# EAGLE design logger2 (EAGLE 6.6.0)
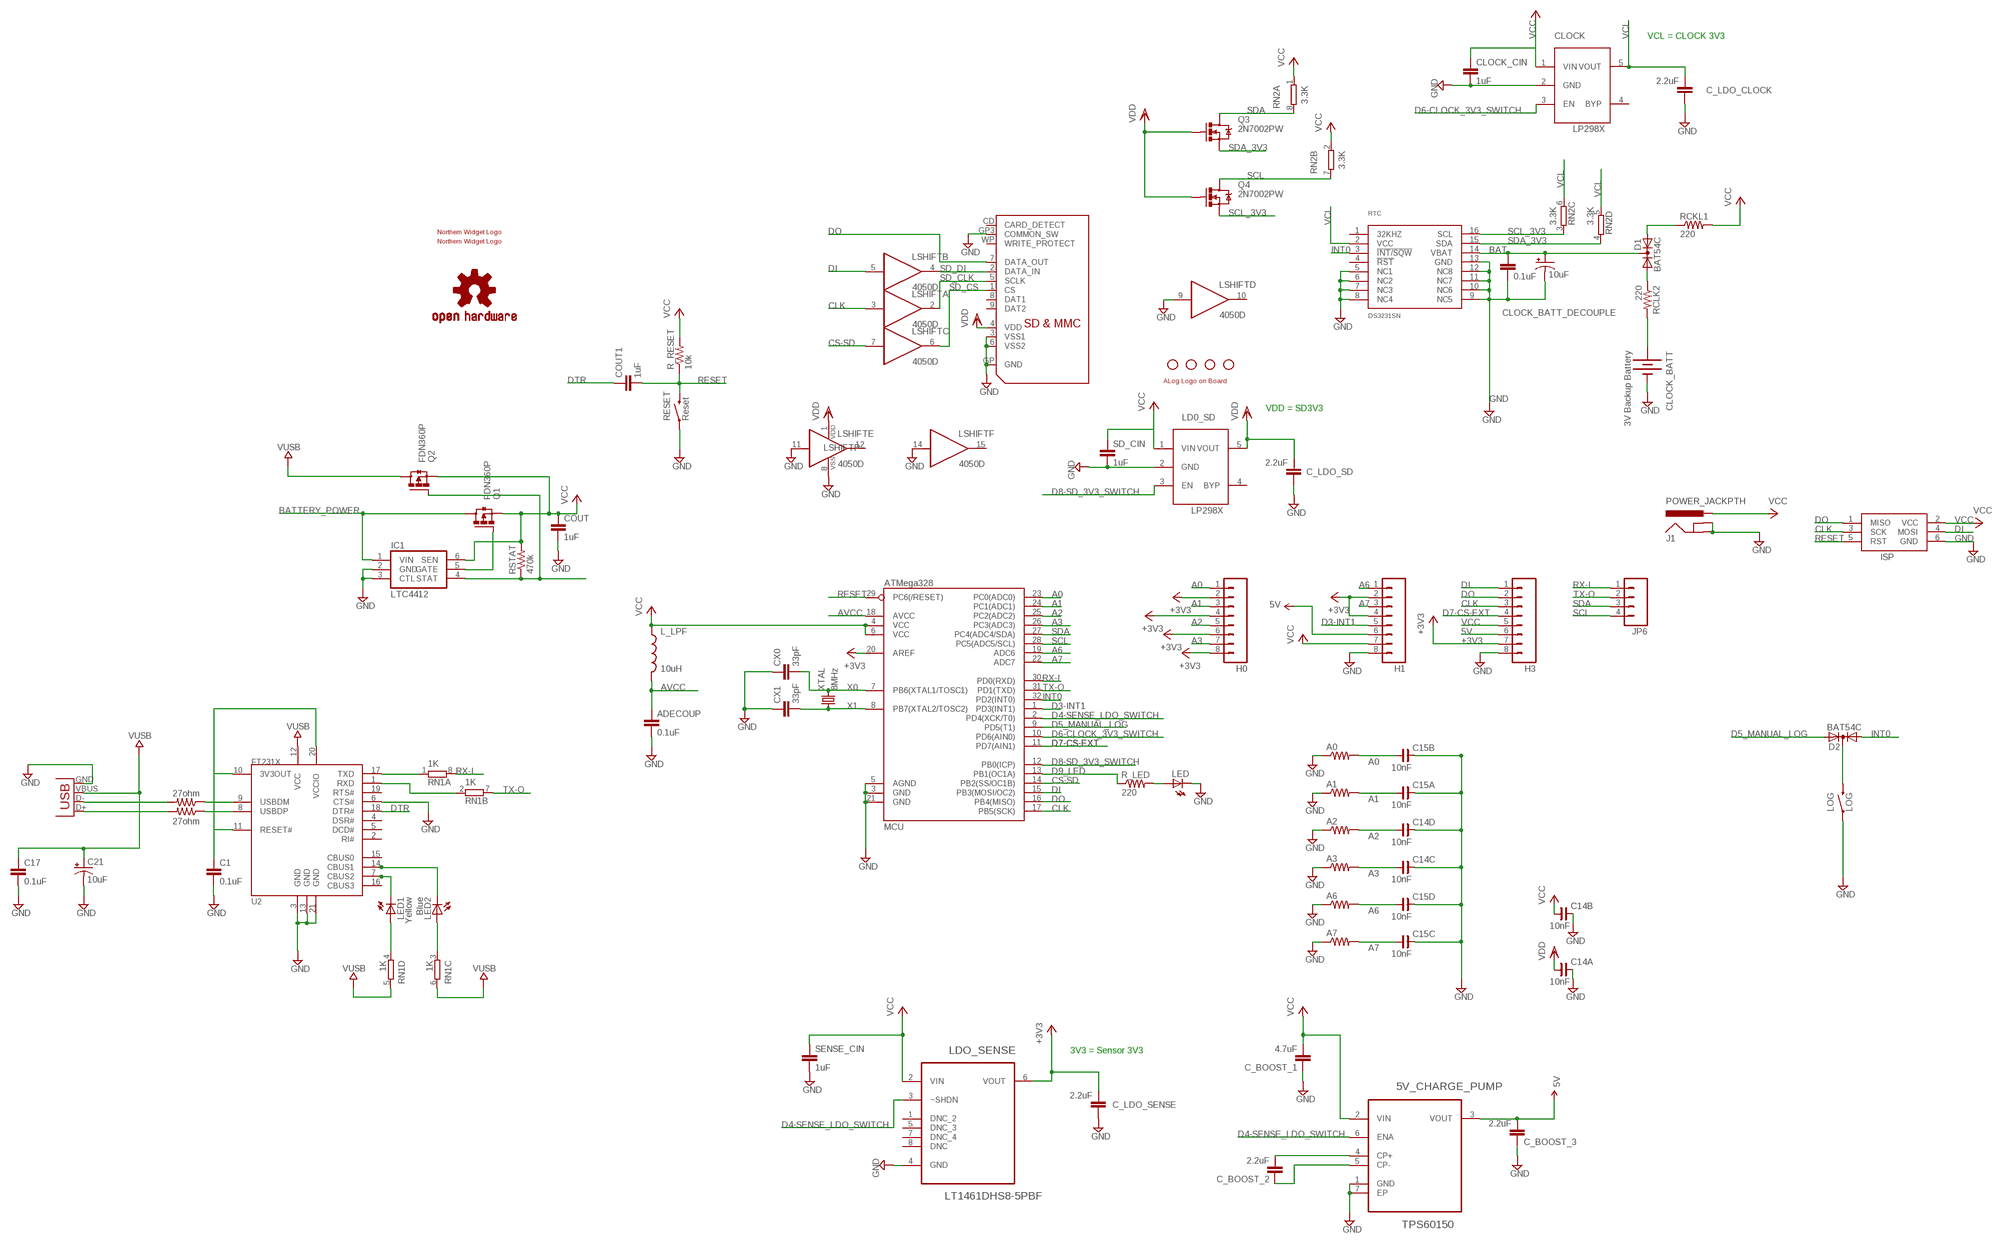
[diagram p0: schematic, sheet 1]

## Parts
5V_CHARGE_PUMP  TPS60150  TPS60150DRVR  [SON65P200X200X80-7N]
A0  R-US_0207/10  [0207/10]
A1  R-US_0207/10  [0207/10]
A2  R-US_0207/10  [0207/10]
A3  R-US_0207/10  [0207/10]
A6  R-US_0207/10  [0207/10]
A7  R-US_0207/10  [0207/10]
ADECOUP  0.1uF  C-EUC0603  [C0603]
C1  0.1uF  C-EUC0603  [C0603]
C14  10nF  CCA_ECJ-1206  [CECJ-1206]
C15  10nF  CCA_ECJ-1206  [CECJ-1206]
C17  0.1uF  C-EUC0603  [C0603]
C21  10uF  CAP_POL1206  [EIA3216]
C_BOOST_1  4.7uF  C-EUC0603  [C0603]
C_BOOST_2  2.2uF  C-EUC0603  [C0603]
C_BOOST_3  2.2uF  C-EUC0603  [C0603]
C_LDO_CLOCK  2.2uF  C-EUC0603  [C0603]
C_LDO_SD  2.2uF  C-EUC0603  [C0603]
C_LDO_SENSE  2.2uF  C-EUC0603  [C0603]
CLOCK  LP2985  LP298XS  [SOT23-5L]
CLOCK_BATT  3V Backup Battery  BATTERY12PTH  [BATTCON_12MM_PTH]
CLOCK_BATT_DECOUP  0.1uF  C-EUC0603  [C0603]
CLOCK_BATT_DECOUPLE  10uF  CAP_POL1206  [EIA3216]
CLOCK_CIN  1uF  C-EUC0603  [C0603]
COUT  1uF  C-EUC0603  [C0603]
COUT1  1uF  C-EUC0603  [C0603]
CX0  33pF  C-EUC0603  [C0603]
CX1  33pF  C-EUC0603  [C0603]
D1  BAT54C  DIODE_AC-CA_  [SOT23C]
D2  BAT54C  DIODE_AC-CA_  [SOT23C]
D+  27ohm  R-US_R0603  [R0603]
D-  27ohm  R-US_R0603  [R0603]
H0  M083.5MM-8  [SCREWTERMINAL-3.5MM-8]
H1  M083.5MM-8  [SCREWTERMINAL-3.5MM-8]
H3  M083.5MM-8  [SCREWTERMINAL-3.5MM-8]
IC1  LTC4412  LTC4412ES6  [TSOT23-6]
ISP  AVRISP-6  [AVRISP]
J1  POWER_JACKPTH  [POWER_JACK_PTH]
JP1  STAND-OFF  [STAND-OFF]
JP2  STAND-OFF  [STAND-OFF]
JP3  STAND-OFF  [STAND-OFF]
JP4  STAND-OFF  [STAND-OFF]
JP5  USB-B  USBPTH  [USB-B-PTH]
JP6  M04SCREW  [SCREWTERMINAL-3.5MM-4]
L_LPF  10uH  INDUCTOR0805  [0805]
LD0_SD  LP2985  LP298XS  [SOT23-5L]
LDO_SENSE  LT1461DHS8-5PBF  [SOIC127P600X175-8N]
LED  LED3MM  [LED3MM]
LED1  Yellow  LED0603  [LED-0603]
LED2  Blue  LED0603  [LED-0603]
LOG  LOG  SWITCH-MOMENTARY-2PTH  [TACTILE-PTH]
LOGO1  OSHW-LOGOM  [OSHW-LOGO-M]
LSHIFT  4050D  [SO16]
MCU  ATMega328  ATMEGA168  [TQFP32-08]
Q1  FDN360P  [SUPER-SOT3]
Q2  FDN360P  [SUPER-SOT3]
Q3  2N7002PW  MOSFET-NCHANNELSOT323  [SOT323]
Q4  2N7002PW  MOSFET-NCHANNELSOT323  [SOT323]
R_LED  220  R-US_R0603  [R0603]
R_RESET  10k  R-US_R0603  [R0603]
RCKL1  220  R-US_R0603  [R0603]
RCLK2  220  R-US_R0603  [R0603]
RESET  Reset  SWITCH-MOMENTARY-2PTH  [TACTILE-PTH]
RN1  1K  4R-N0603-ARC  [0603-ARC]
RN2  3.3K  4R-N0603-ARC  [0603-ARC]
RSTAT  470k  R-US_R0603  [R0603]
RTC  DS3231SN  [SO16W]
SD  SDMMC06132  [06132]
SD_CIN  1uF  C-EUC0603  [C0603]
SENSE_CIN  1uF  C-EUC0603  [C0603]
U2  FT231X-Q  [QFN20]
U$1  NWLOGO  [NWLOGO]
U$2  ALOG_LOGO_V1_5.5MM  [ALOG_LOGO_V1_SMALL]
U$3  NWLOGO_MED  [NWLOGO_MED]
XTAL  8MHz  CRYSTALHC49UV  [HC49U-V]

## Nets
5V: 5V_CHARGE_PUMP.3(VOUT) C_BOOST_3.2 H1.6 H3.6
+3V3: C_LDO_SENSE.2 H0.2 H0.4 H0.6 H0.8 H1.2 H1.4 H3.7 LDO_SENSE.6(VOUT) MCU.20(AREF)
A0: A0.2 C15.B1 H0.1 MCU.23(PC0(ADC0))
A1: A1.2 C15.A1 H0.3 MCU.24(PC1(ADC1))
A2: A2.2 C14.D1 H0.5 MCU.25(PC2(ADC2))
A3: A3.2 C14.C1 H0.7 MCU.26(PC3(ADC3))
A6: A6.2 C15.D1 H1.1 MCU.19(ADC6)
A7: A7.2 C15.C1 H1.3 MCU.22(ADC7)
AVCC: ADECOUP.1 L_LPF.2 MCU.18(AVCC)
BAT: CLOCK_BATT_DECOUP.1 CLOCK_BATT_DECOUPLE.A(+) D1.3(K) RTC.14(VBAT)
BATTERY_POWER: IC1.1(VIN) Q1.3(D)
CLK: H3.3 ISP.3(SCK) LSHIFT.3(A:I) MCU.17(PB5(SCK))
CS-SD: LSHIFT.7(C:I) MCU.14(PB2(SS/OC1B))
D3-INT1: H1.5 MCU.1(PD3(INT1))
D4-SENSE_LDO_SWITCH: 5V_CHARGE_PUMP.6(ENA) LDO_SENSE.3(~SHDN) MCU.2(PD4(XCK/T0))
D5_MANUAL_LOG: D2.2(A2) MCU.9(PD5(T1))
D6-CLOCK_3V3_SWITCH: CLOCK.3(EN) MCU.10(PD6(AIN0))
D7-CS-EXT: H3.4 MCU.11(PD7(AIN1))
D8-SD_3V3_SWITCH: LD0_SD.3(EN) MCU.12(PB0(ICP))
D9_LED: MCU.13(PB1(OC1A)) R_LED.1
DI: H3.1 ISP.4(MOSI) LSHIFT.5(B:I) MCU.15(PB3(MOSI/OC2))
DO: H3.2 ISP.1(MISO) MCU.16(PB4(MISO)) SD.7(DATA_OUT)
DTR: COUT1.1 U2.18(DTR#)
GND: 5V_CHARGE_PUMP.1(GND) 5V_CHARGE_PUMP.7(EP) A0.1 A1.1 A2.1 A3.1 A6.1 A7.1 ADECOUP.2 C1.2 C14.A2 C14.B2 C14.C2 C14.D2 C15.A2 C15.B2 C15.C2 C15.D2 C17.2 C21.C(-) C_BOOST_1.1 C_BOOST_3.1 C_LDO_CLOCK.1 C_LDO_SD.1 C_LDO_SENSE.1 CLOCK.2(GND) CLOCK_BATT.GND(-) CLOCK_BATT_DECOUP.2 CLOCK_BATT_DECOUPLE.C(-) CLOCK_CIN.2 COUT.2 CX0.1 CX1.1 H1.8 H3.8 IC1.2(GND) IC1.3(CTL) ISP.6(GND) J1.GND J1.GNDBREAK JP5.GND LD0_SD.2(GND) LDO_SENSE.4(GND) LED.K(C) LOG.1 LSHIFT.8(P:VSS) LSHIFT.9(D:I) LSHIFT.11(E:I) LSHIFT.14(F:I) MCU.3(GND) MCU.5(AGND) MCU.21(GND) RESET.1 RTC.5(NC1) RTC.6(NC2) RTC.7(NC3) RTC.8(NC4) RTC.9(NC5) RTC.10(NC6) RTC.11(NC7) RTC.12(NC8) RTC.13(GND) SD.3(VSS1) SD.6(VSS2) SD.GP3(COMMON_SW) SD.GP(GND) SD_CIN.2 SENSE_CIN.2 U2.3(GND) U2.6(CTS#) U2.13(GND) U2.21(GND)
INT0: D2.1(A1) MCU.32(PD2(INT0)) RTC.3(!INT/SQW)
LED+: LED.A R_LED.2
N$1: D1.1(A1) RCLK2.1
N$2: CLOCK_BATT.VCC@1(+) RCLK2.2
N$3: D+.2 JP5.D+
N$4: D-.2 JP5.D-
N$5: LED1.C U2.7(CBUS2)
N$6: LED2.C U2.14(CBUS1)
N$7: IC1.4(STAT) Q2.1(G) RSTAT.1
N$8: IC1.5(GATE) Q1.1(G)
N$9: LED1.A RN1.4
N$10: LED2.A RN1.3
N$11: D2.3(K) LOG.3
N$13: D-.1 U2.9(USBDM)
N$14: 5V_CHARGE_PUMP.4(CP+) C_BOOST_2.2
N$15: 5V_CHARGE_PUMP.5(CP-) C_BOOST_2.1
N$16: D+.1 U2.8(USBDP)
N$17: C1.1 U2.10(3V3OUT) U2.11(RESET#) U2.20(VCCIO)
N$27: RN1.1 U2.17(TXD)
N$29: RN1.2 U2.1(RXD)
N$67: D1.2(A2) RCKL1.1
RESET: COUT1.2 ISP.5(RST) MCU.29(PC6(/RESET)) R_RESET.1 RESET.3
RX-I: JP6.1 MCU.30(PD0(RXD)) RN1.8
SCL: JP6.4 MCU.28(PC5(ADC5/SCL)) Q4.3(D) RN2.7
SCL_3V3: Q4.2(S) RN2.3 RTC.16(SCL)
SD_CLK: LSHIFT.2(A:O) SD.5(SCLK)
SD_CS: LSHIFT.6(C:O) SD.1(CS)
SD_DI: LSHIFT.4(B:O) SD.2(DATA_IN)
SDA: JP6.3 MCU.27(PC4(ADC4/SDA)) Q3.3(D) RN2.8
SDA_3V3: Q3.2(S) RN2.4 RTC.15(SDA)
TX-O: JP6.2 MCU.31(PD1(TXD)) RN1.7
VCC: 5V_CHARGE_PUMP.2(VIN) C14.B1 C_BOOST_1.2 CLOCK.1(VIN) CLOCK_CIN.1 COUT.1 H1.7 H3.5 IC1.6(SEN) ISP.2(VCC) J1.PWR L_LPF.1 LD0_SD.1(VIN) LDO_SENSE.2(VIN) MCU.4(VCC) MCU.6(VCC) Q1.2(S) Q2.2(S) R_RESET.2 RCKL1.2 RN2.1 RN2.2 RSTAT.2 SD_CIN.1 SENSE_CIN.1
VCL: C_LDO_CLOCK.2 CLOCK.5(VOUT) RN2.5 RN2.6 RTC.2(VCC)
VDD: C14.A1 C_LDO_SD.2 LD0_SD.5(VOUT) LSHIFT.1(P:VDD) Q3.1(G) Q4.1(G) SD.4(VDD)
VUSB: C17.1 C21.A(+) JP5.VBUS Q2.3(D) RN1.5 RN1.6 U2.12(VCC)
X0: CX0.2 MCU.7(PB6(XTAL1/TOSC1)) XTAL.2
X1: CX1.2 MCU.8(PB7(XTAL2/TOSC2)) XTAL.1
Unconnected: CLOCK.4(BYP) LD0_SD.4(BYP) LDO_SENSE.1(DNC_2) LDO_SENSE.5(DNC_3) LDO_SENSE.7(DNC_4) LDO_SENSE.8(DNC) LSHIFT.10(D:O) LSHIFT.12(E:O) LSHIFT.15(F:O) RTC.1(32KHZ) RTC.4(!RST) SD.8(DAT1) SD.9(DAT2) SD.CD(CARD_DETECT) SD.WP(WRITE_PROTECT) U2.2(RI#) U2.4(DSR#) U2.5(DCD#) U2.15(CBUS0) U2.16(CBUS3) U2.19(RTS#)

## Notes on the sheet
- VCL = CLOCK 3V3
- VDD = SD3V3
- 3V3 = Sensor 3V3

## Library data of the parts
5V_CHARGE_PUMP = ti_by_element14:TPS60150DRVR: Charge Pump Device; MPN: TPS60150DRVR; OC_FARNELL: -; OC_NEWARK: 45P8283; PACKAGE: SON-6; SUPPLIER: Texas Instruments
A0 A1-A3 A6 A7 R_LED = resistor:R-US_: RESISTOR, American symbol
ADECOUP C1 C17 C_BOOST_1-C_BOOST_3 C_LDO_CLOCK C_LDO_SD C_LDO_SENSE CX0 CX1 = resistor:C-EU: CAPACITOR, European symbol
C14 C15 = rc-master-smd:CCA_: CHIP CAP ARRAY
C21 CLOCK_BATT_DECOUPLE = SparkFun-Passives:CAP_POL: Capacitor Polarized These are standard SMD and PTH capacitors. Normally 10uF, 47uF, and 100uF in electrolytic and tantalum varieties. Always verify the external diameter of the through hole cap, it varies with capacity, voltage, and manufacturer. The EIA devices should be standard.
CLOCK LD0_SD = adafruit:LP298X
CLOCK_BATT = SparkFun:BATTERY: Battery Holders Various common sizes : AA, AAA, 20mm coin cell and 12mm coin cell.
CLOCK_BATT_DECOUP CLOCK_CIN COUT COUT1 SD_CIN SENSE_CIN = rcl:C-EU: CAPACITOR, European symbol
D1 D2 = semicon-smd-ipc:DIODE_AC-CA_: DUAL DIODE
D+ D- R_RESET RCKL1 RCLK2 RSTAT = rcl:R-US_: RESISTOR, American symbol
H0 H1 H3 = SparkFun:M08: Header 8 Standard 8-pin 0.1" header. Use with straight break away headers (SKU : PRT-00116), right angle break away headers (PRT-00553), swiss pins (PRT-00743), machine pins (PRT-00117), and female headers (PRT-00115).
IC1 = awickert:LTC4412*: Low Loss PowerPath Controller
ISP = adafruit:AVRISP: AVR ISP HEADER Standard 6 pin header for AVR programming
J1 = SparkFun:POWER_JACK: Power Jack This is the standard 5.5mm barrel jack for power. The PTH is the most common, proven, reliable, footprint. All others are experimental. The Slot footprint only works if the mill layer is transmitted to the PCB fab house so be warned. Spark Fun Electronics SKU : PRT-00119. Mating wall wart : TOL-00298 (and others)
JP1-JP4 = SparkFun:STAND-OFF: Stand Off This is the mechanical footprint for a #4 phillips button head screw. Use the keepout ring to avoid running the screw head into surrounding components. SKU : PRT-00447
JP5 = SparkFun-Connectors:USB: USB Connectors USB-B-PTH is fully proven SKU : PRT-00139/CONN-08278 USB-miniB is fully proven SKU : PRT-00587 USB-A-PCB is untested. USB-A-H is throughly reviewed, but untested. Spark Fun Electronics SKU : PRT-00437 USB-B-SMT is throughly reviewed, but untested. Needs silkscreen touching up. USB-A-S has not been used/tested USB-MB-H has not been used/tested USB-MICROB has been used. CONN-09505; PROD_ID: CONN-08278
JP6 = SparkFun-Connectors:M04: Header 4 Standard 4-pin 0.1" header. Use with straight break away headers (SKU : PRT-00116), right angle break away headers (PRT-00553), swiss pins (PRT-00743), machine pins (PRT-00117), and female headers (PRT-00115). Molex polarized connector foot print use with SKU : PRT-08231 with associated crimp pins and housings. 1MM SMD Version SKU: PRT-10208; PROD_ID: Combine 2x8399
L_LPF = SparkFun:INDUCTOR: Inductors Basic Inductor/Choke - 0603 and 1206. Footprints are not proven and vary greatly between part numbers.
LDO_SENSE = LTC_By_element14_Batch_1:LT1461DHS8-5PBF: Micropower Precision Low Dropout Series Voltage Reference Family; MPN: LT1461DHS8-5#PBF; OC_FARNELL: 1663431; OC_NEWARK: 57M4326; PACKAGE: SOIC-8; SUPPLIER: Linear Technology
LED = SparkFun:LED: LEDs Standard schematic elements and footprints for 5mm, 3mm, 1206, and 0603 sized LEDs. 5mm - Spark Fun Electronics SKU : COM-00529 (and others)
LED1 LED2 = SparkFun-LED:LED: LEDs Standard schematic elements and footprints for 5mm, 3mm, 1206, and 0603 sized LEDs. 5mm - Spark Fun Electronics SKU : COM-00529 (and others)
LOG RESET = SparkFun-Electromechanical:SWITCH-MOMENTARY-2: Various NO switches- pushbuttons, reed, etc; PROD_ID: SWCH-08441
LOGO1 = SparkFun-Aesthetics:OSHW-LOGO: Open Source Hardware Logo This logo indicates the piece of hardware it is found on incorporates a OSHW license and/or adheres to the definition of open source hardware found here: http://freedomdefined.org/OSHW
LSHIFT = 40xx:4050: Hex non-inverting BUFFER
MCU = SparkFun:ATMEGA168
Q1 Q2 = transistor-power:FDN360P: Single P-Channel, PowerTrench (R) MOSFET Source: http://www.fairchildsemi.com/ds/FD/FDN360P.pdf
Q3 Q4 = SparkFun-DiscreteSemi:MOSFET-NCHANNEL: Generic NMOS footprint
RN1 RN2 = resistor-dil:4R-N: Array Chip Resistor Source: RS Component / Phycomp; OC_FARNELL: unknown; OC_NEWARK: unknown
RTC = comfile:DS3231SN
SD = adafruit:SDMMC: SD MMC Card holder 4UCON part #06132 - easy to solder
U2 = FT231X:FT231X
U$1 = awickert:NWLOGO
U$2 = awickert:ALOG_LOGO_V1_5.5MM
U$3 = awickert:NWLOGO_MED: Medium-sized Northern Widget logo
XTAL = SparkFun:CRYSTAL: Crystals Various standard crystals. Proven footprints. Spark Fun Electronics SKU : COM-00534

## Net classes
0 default: width 0.203 mm, drill 0.305 mm
1 power: width 0.305 mm, drill 0.508 mm
2 gnd: width 0.61 mm, drill 0.508 mm, clearance 0.203 mm
3 usbvcc: width 0.508 mm, drill 0.508 mm, clearance 0.152 mm
4 aref: width 0.406 mm

## Board
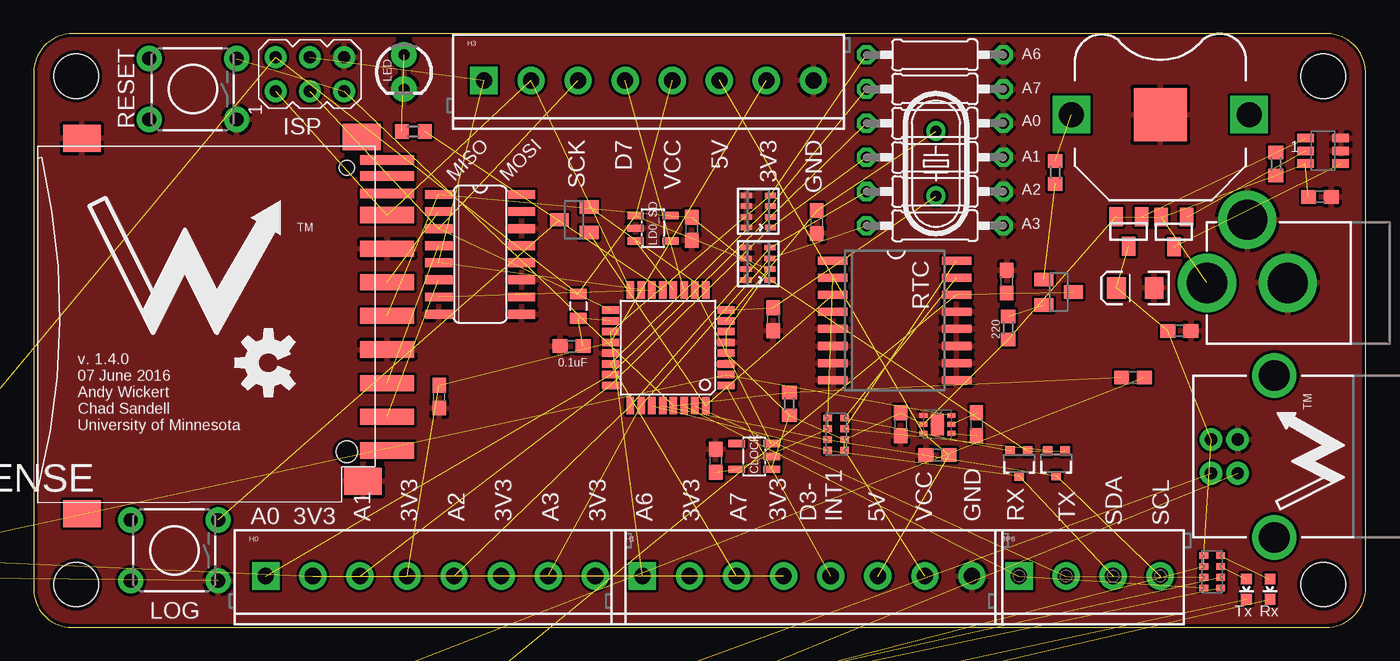
[diagram p1: board, top side]
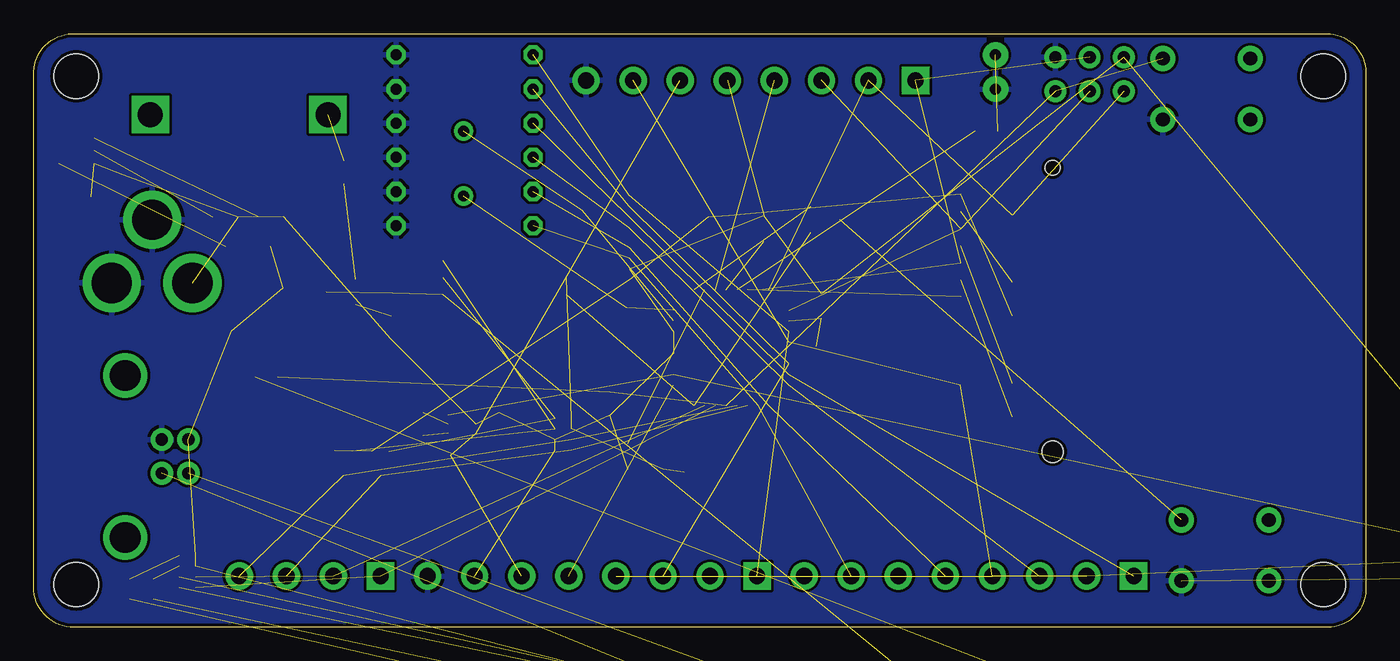
[diagram p2: board, bottom side, seen from below]

Size 99.05 x 44.12 mm. Coordinates in mm from the lower left corner, seen from the top.
Outline: 99.05,41.32 arc90 95.93,44.12 2.91,44.12 arc90 0,41.21 0,2.85 arc90 2.85,0 96.06,0 arc90 99.05,2.98 99.05,41.32
Copper layers (1*16): Top 0.035mm / dielectric 1.5mm / Bottom 0.035mm
Design rules "SparkFun *": minimum track width 8mil, minimum drill 12mil, track to track 8mil, track to pad 8mil, pad to pad 8mil, via to via 8mil, smd to smd 8mil, copper to edge 10mil, drill to drill 8mil, minimum pad ring 12mil, minimum via ring 10mil, stop-mask expansion 4mil, vias tented up to drill 25mil, thermal gap 10mil

### Footprints (pad centres in the part's own frame; a part is rotated, then mirrored left to right if it is on the bottom)
SON65P200X200X80-7N = smd 0.61 x 0.356: 1 -1.041,0.66; 2 -1.041,0; 3 -1.041,-0.66; 4 1.041,-0.66; 5 1.041,0; 6 1.041,0.66 | smd 0.991 x 1.6: 7 0,0
0207/10 = drill 0.813 octagon: 1 -5.08,0; 2 5.08,0
C0603 = smd 1.1 x 1: 1 -0.85,0; 2 0.85,0
CECJ-1206 = smd 0.406 x 0.813: A1 -1.2,-0.9; A2 -1.2,0.9; B1 -0.4,-0.9; B2 -0.4,0.9; C1 0.4,-0.9; C2 0.4,0.9; D1 1.2,-0.9; D2 1.2,0.9
EIA3216 = smd 1.4 x 1.6: A 1.4,0; C -1.4,0
SOT23-5L = smd 0.55 x 1.2: 1 -0.95,-1.3; 2 0,-1.3; 3 0.95,-1.3; 4 0.95,1.3; 5 -0.95,1.3
BATTCON_12MM_PTH = smd 3.962 x 3.962: GND 0,0 | drill 1.854 square: VCC@1 -6.604,0; VCC@2 6.604,0
SOT23C = smd 1 x 1.4: 1 -0.95,-1.1; 2 0.95,-1.1; 3 0,1.1
R0603 = smd 1 x 1.1: 1 -0.85,0; 2 0.85,0
SCREWTERMINAL-3.5MM-8 = drill 1.2 pad 2.032 square: 1 0,0 | drill 1.2 pad 2.032: 2 3.5,0; 3 7,0; 4 10.5,0; 5 14,0; 6 17.5,0; 7 21,0; 8 24.5,0
TSOT23-6 = smd 0.622 x 1.22: 1 -0.95,-1.31; 2 0,-1.31; 3 0.95,-1.31; 4 0.95,1.31; 5 0,1.31; 6 -0.95,1.31
AVRISP = drill 0.9 pad 1.626: 1 -1.27,2.54; 2 1.27,2.54; 3 -1.27,0; 4 1.27,0; 5 -1.27,-2.54; 6 1.27,-2.54
POWER_JACK_PTH = drill 2.997 pad 4.318: GND 0,7.7; GNDBREAK 4.7,10.7; PWR 0,13.7
STAND-OFF = hole 3.302: 0,0
USB-B-PTH = drill 0.914 pad 1.676: D+ 0,1.25; D- 1.981,1.25; GND 0,-1.25; VBUS 1.981,-1.25 | drill 2.286: S1 -2.718,-6.02; S2 -2.718,6.02
SCREWTERMINAL-3.5MM-4 = drill 1.2 pad 2.032 square: 1 0,0 | drill 1.2 pad 2.032: 2 3.5,0; 3 7,0; 4 10.5,0
0805 = smd 0.8 x 1.2: 1 -0.9,0; 2 0.9,0
SOIC127P600X175-8N = smd 1.981 x 0.533: 1 -2.464,1.905; 2 -2.464,0.635; 3 -2.464,-0.635; 4 -2.464,-1.905; 5 2.464,-1.905; 6 2.464,-0.635; 7 2.464,0.635; 8 2.464,1.905
LED3MM = drill 0.813 pad 1.88: A -1.27,0; K 1.27,0
LED-0603 = smd 0.8 x 0.8: A 0,-0.75; C 0,0.75
TACTILE-PTH = drill 1.016 pad 1.88: 1 -3.251,2.261; 2 3.251,2.261; 3 -3.251,-2.261; 4 3.251,-2.261
SO16 = smd 0.66 x 2.032: 1 -4.445,-3.073; 2 -3.175,-3.073; 3 -1.905,-3.073; 4 -0.635,-3.073; 5 0.635,-3.073; 6 1.905,-3.073; 7 3.175,-3.073; 8 4.445,-3.073; 9 4.445,3.073; 10 3.175,3.073; 11 1.905,3.073; 12 0.635,3.073; 13 -0.635,3.073; 14 -1.905,3.073; 15 -3.175,3.073; 16 -4.445,3.073
TQFP32-08 = smd 1.27 x 0.559: 1 -4.293,2.8; 2 -4.293,2; 3 -4.293,1.2; 4 -4.293,0.4; 5 -4.293,-0.4; 6 -4.293,-1.2; 7 -4.293,-2; 8 -4.293,-2.8; 17 4.293,-2.8; 18 4.293,-2; 19 4.293,-1.2; 20 4.293,-0.4; 21 4.293,0.4; 22 4.293,1.2; 23 4.293,2; 24 4.293,2.8 | smd 0.559 x 1.27: 9 -2.8,-4.293; 10 -2,-4.293; 11 -1.2,-4.293; 12 -0.4,-4.293; 13 0.4,-4.293; 14 1.2,-4.293; 15 2,-4.293; 16 2.8,-4.293; 25 2.8,4.293; 26 2,4.293; 27 1.2,4.293; 28 0.4,4.293; 29 -0.4,4.293; 30 -1.2,4.293; 31 -2,4.293; 32 -2.8,4.293
SUPER-SOT3 = smd 1 x 1.4: 1 -0.95,-1.1; 2 0.95,-1.1; 3 0,1.1
SOT323 = smd 0.7 x 0.7: 1 -0.65,-0.925; 2 0.65,-0.925; 3 0,0.925
0603-ARC = smd 0.5 x 0.65: 1 -1.2,-0.625; 2 -0.4,-0.625; 3 0.4,-0.625; 4 1.2,-0.625; 5 1.2,0.625; 6 0.4,0.625; 7 -0.4,0.625; 8 -1.2,0.625
SO16W = smd 0.6 x 2.2: 1 -4.445,-4.6; 2 -3.175,-4.6; 3 -1.905,-4.6; 4 -0.635,-4.6; 5 0.635,-4.6; 6 1.905,-4.6; 7 3.175,-4.6; 8 4.445,-4.6; 9 4.445,4.6; 10 3.175,4.6; 11 1.905,4.6; 12 0.635,4.6; 13 -0.635,4.6; 14 -1.905,4.6; 15 -3.175,4.6; 16 -4.445,4.6
06132 = smd 1.2 x 4: 1 6.9,0.9; 2 4.4,0.9; 3 1.9,0.9; 4 -0.6,0.9; 5 -3.1,0.9; 6 -5.6,0.9; 7 -8.1,0.9; 9 9.4,0.9 | smd 0.7 x 4: 8 -9.7,0.9; CD -11,0.9; WP -12.2,0.9 | smd 2 x 2.8: GP -13.8,-21.8; GP2 14.1,-21.8; GP3 11.7,-0.9; GP4 -13.9,-1 | hole 1.1: -11.6,-2.1 | hole 1.6: 9.5,-2.1
QFN20 = smd 1 x 0.25: 1 -2.032,0.968; 2 -2.032,0.468; 3 -2.032,-0.032; 4 -2.032,-0.532; 5 -2.032,-1.032; 11 1.968,-1.032; 12 1.968,-0.532; 13 1.968,-0.032; 14 1.968,0.468; 15 1.968,0.968 | smd 0.25 x 1: 6 -1.032,-2.032; 7 -0.532,-2.032; 8 -0.032,-2.032; 9 0.468,-2.032; 10 0.968,-2.032; 16 0.968,1.968; 17 0.468,1.968; 18 -0.032,1.968; 19 -0.532,1.968; 20 -1.032,1.968 | smd 2 x 2: 21 -0.032,-0.032
HC49U-V = drill 0.813: 1 -2.413,0; 2 2.413,0

### Placement (x,y rotation side)
5V_CHARGE_PUMP  67.2,15.09 0 top
A0  67.01,37.47 180 top
A1  67.01,34.92 180 top
A2  67.01,32.38 180 top
A3  67.01,29.84 180 top
A6  67.01,42.55 180 top
A7  67.01,40.01 180 top
ADECOUP  40,20.89 180 top
C1  -12.2,-34.44 0 top  (outside the outline)
C14  53.86,27.01 90 top
C15  53.89,30.91 90 top
C17  85.18,22.04 0 top
C21  81.9,25.23 180 top
C_BOOST_1  64.46,15.09 90 top
C_BOOST_2  70.09,15.09 270 top
C_BOOST_3  67.2,12.8 0 top
C_LDO_CLOCK  50.7,12.38 270 top
C_LDO_SD  48.92,29.62 90 top
C_LDO_SENSE  30.15,17.14 90 top
CLOCK  53.57,12.7 90 top
CLOCK_BATT  83.77,38.1 0 top
CLOCK_BATT_DECOUP  72.34,25.69 90 top
CLOCK_BATT_DECOUPLE  -10.68,-39.01 0 top  (outside the outline)
CLOCK_CIN  -12.2,-3.2 0 top  (outside the outline)
COUT  95.63,31.99 0 top
COUT1  81.74,18.57 180 top
CX0  58.23,30.12 90 top
CX1  54.98,22.9 90 top
D1  76.2,24.91 270 top
D2  40.19,30.29 90 top
D+  -12.2,-29.57 0 top  (outside the outline)
D-  -12.2,-24.69 0 top  (outside the outline)
H0  17.26,3.81 0 top
H1  45.26,3.81 0 top
H3  33.48,40.64 0 top
IC1  95.86,35.41 90 top
ISP  20.54,41.11 90 top
J1  100.94,25.59 90 top
JP1  3.17,3.17 0 top
JP2  95.88,40.96 90 top
JP3  95.88,3.17 90 top
JP4  3.17,40.96 0 top
JP5  89.52,12.7 180 top
JP6  73.26,3.81 0 top
L_LPF  40.49,23.88 270 top
LD0_SD  46.04,29.65 270 top
LDO_SENSE  -9.61,5.64 0 top  (outside the outline)
LED  27.54,41.27 270 top
LED1  91.92,2.83 180 top
LED2  90.17,2.83 180 top
LOG  10.47,5.71 180 top
LOGO1  17.45,19.66 90 top
LSHIFT  33.2,27.72 270 top
MCU  47.17,20.78 180 top
Q1  84.77,29.39 180 top
Q2  81.41,29.42 180 top
Q3  73.27,12.18 180 top
Q4  76.03,12.19 180 top
R_LED  28.22,36.86 180 top
R_RESET  56.19,16.61 270 top
RCKL1  72.46,22.25 270 top
RCLK2  75.95,33.81 90 top
RESET  11.84,40.01 180 top
RN1  87.62,4.13 90 top
RN2  59.67,14.35 90 top
RSTAT  92.36,34.43 270 top
RTC  64.02,22.81 270 top
SD  25.39,22.54 270 top
SD_CIN  -12.2,-8.08 0 top  (outside the outline)
SENSE_CIN  -12.2,-12.95 0 top  (outside the outline)
U2  -10.68,-19.66 0 top  (outside the outline)
U$1  11.2,26.47 0 top
U$2  74.21,56.98 0 top  (outside the outline)
U$3  94.48,12.32 90 top
XTAL  67.08,34.47 90 top

### Tracks (layer width: path | path; a pad name or v marks a point on that pad's centre or on a via)
5V  (3 unrouted)
+3V3  (9 unrouted)
A0  (3 unrouted)
A1  (3 unrouted)
A2  (3 unrouted)
A3  (3 unrouted)
A6  (3 unrouted)
A7  (3 unrouted)
AVCC  (2 unrouted)
BAT  (3 unrouted)
BATTERY_POWER  (1 unrouted)
CLK  (3 unrouted)
CS-SD  (1 unrouted)
D3-INT1  (1 unrouted)
D4-SENSE_LDO_SWITCH  (2 unrouted)
D5_MANUAL_LOG  (1 unrouted)
D6-CLOCK_3V3_SWITCH  (1 unrouted)
D7-CS-EXT  (1 unrouted)
D8-SD_3V3_SWITCH  (1 unrouted)
D9_LED  (1 unrouted)
DI  (3 unrouted)
DO  (3 unrouted)
DTR  (1 unrouted)
GND  (10 unrouted)
  pour Bottom: -0.33,44.45 -0.33,-0.32 99.37,-0.32 99.37,44.45
  pour Top: -0.65,44.77 -0.65,-0.64 99.68,-0.64 99.68,44.77
INT0  (2 unrouted)
LED+  (1 unrouted)
N$1  (1 unrouted)
N$2  (1 unrouted)
N$3  (1 unrouted)
N$4  (1 unrouted)
N$5  (1 unrouted)
N$6  (1 unrouted)
N$7  (2 unrouted)
N$8  (1 unrouted)
N$9  (1 unrouted)
N$10  (1 unrouted)
N$11  (1 unrouted)
N$13  (1 unrouted)
N$14  (1 unrouted)
N$15  (1 unrouted)
N$16  (1 unrouted)
N$17  (3 unrouted)
N$27  (1 unrouted)
N$29  (1 unrouted)
N$67  (1 unrouted)
RESET  (4 unrouted)
RX-I  (2 unrouted)
SCL  (3 unrouted)
SCL_3V3  (2 unrouted)
SD_CLK  (1 unrouted)
SD_CS  (1 unrouted)
SD_DI  (1 unrouted)
SDA  (3 unrouted)
SDA_3V3  (2 unrouted)
TX-O  (2 unrouted)
VCC  (24 unrouted)
VCL  (4 unrouted)
VDD  (6 unrouted)
VUSB  (6 unrouted)
X0  (2 unrouted)
X1  (2 unrouted)

### Text on the board
tPlace: TM | MISO | MOSI | SCK | D7 | VCC | 5V | 3V3 | GND | 1 | TM | TM | v. 1.4.0 / 07 June 2016 / Andy Wickert / Chad Sandell / University of Minnesota | A0 | 3V3 | A1 | 3V3 | A2 | 3V3 | A3 | 3V3 | A6 | 3V3 | A7 | 3V3 | D3- / INT1 | 5V | VCC | GND | RX | TX | SDA | SCL | Tx | Rx